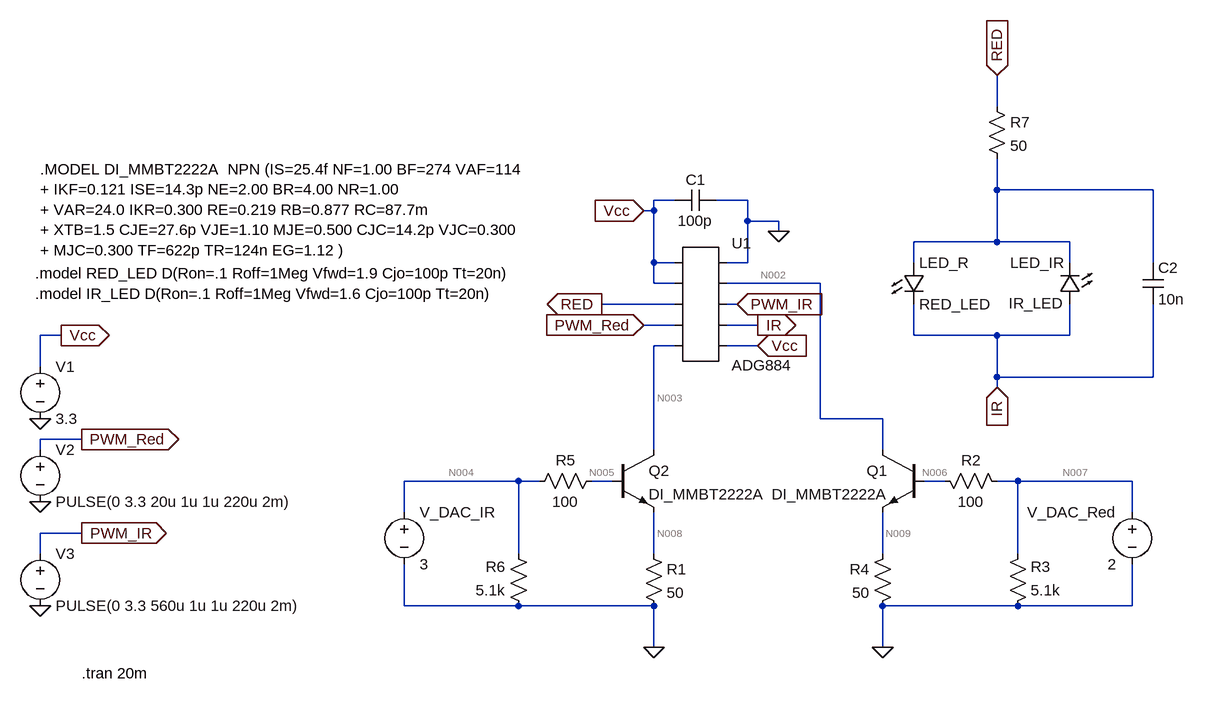
[diagram p0: schematic Mulitplexer.asc]
Mulitplexer.asc, the LTspice schematic file:
Version 4
SHEET 1 1976 680
WIRE 992 -304 992 -352
WIRE 992 -176 992 -224
WIRE 1232 -176 992 -176
WIRE 496 -160 464 -160
WIRE 608 -160 560 -160
WIRE 464 -144 464 -160
WIRE 464 -144 448 -144
WIRE 608 -128 608 -160
WIRE 656 -128 608 -128
WIRE 656 -112 656 -128
WIRE 992 -96 992 -176
WIRE 992 -96 864 -96
WIRE 1104 -96 992 -96
WIRE 464 -64 464 -144
WIRE 496 -64 464 -64
WIRE 608 -64 608 -128
WIRE 608 -64 576 -64
WIRE 864 -64 864 -96
WIRE 1104 -64 1104 -96
WIRE 1232 -64 1232 -176
WIRE 464 -32 464 -64
WIRE 496 -32 464 -32
WIRE 720 -32 576 -32
WIRE 496 0 384 0
WIRE 592 0 576 0
WIRE 496 32 448 32
WIRE 624 32 576 32
WIRE -448 48 -480 48
WIRE 864 48 864 0
WIRE 992 48 864 48
WIRE 1104 48 1104 0
WIRE 1104 48 992 48
WIRE 496 64 464 64
WIRE 624 64 576 64
WIRE -480 96 -480 48
WIRE 992 112 992 48
WIRE 1232 112 1232 0
WIRE 1232 112 992 112
WIRE 992 128 992 112
WIRE 720 176 720 -32
WIRE 816 176 720 176
WIRE -416 208 -480 208
WIRE -480 224 -480 208
WIRE 464 224 464 64
WIRE 816 224 816 176
WIRE 256 272 80 272
WIRE 288 272 256 272
WIRE 400 272 368 272
WIRE 912 272 880 272
WIRE 1024 272 992 272
WIRE 1200 272 1024 272
WIRE 80 320 80 272
WIRE 1200 320 1200 272
WIRE -416 352 -480 352
WIRE -480 384 -480 352
WIRE 256 384 256 272
WIRE 464 384 464 320
WIRE 816 384 816 320
WIRE 1024 384 1024 272
WIRE 80 464 80 400
WIRE 256 464 80 464
WIRE 464 464 256 464
WIRE 1024 464 816 464
WIRE 1200 464 1200 400
WIRE 1200 464 1024 464
WIRE 464 528 464 464
WIRE 816 528 816 464
FLAG -448 48 Vcc
IOPIN -448 48 Out
FLAG -416 208 PWM_Red
IOPIN -416 208 Out
FLAG -416 352 PWM_IR
IOPIN -416 352 Out
FLAG -480 176 0
FLAG -480 304 0
FLAG -480 464 0
FLAG 448 -144 Vcc
IOPIN 448 -144 In
FLAG 624 64 Vcc
IOPIN 624 64 In
FLAG 656 -112 0
FLAG 448 32 PWM_Red
IOPIN 448 32 In
FLAG 384 0 RED
IOPIN 384 0 Out
FLAG 624 32 IR
IOPIN 624 32 Out
FLAG 992 -352 RED
IOPIN 992 -352 In
FLAG 992 128 IR
IOPIN 992 128 In
FLAG 816 528 0
FLAG 592 0 PWM_IR
IOPIN 592 0 In
FLAG 464 528 0
SYMBOL AutoGenerated\\ADG884 528 0 R0
SYMATTR InstName U1
SYMBOL LED 848 -64 R0
SYMATTR InstName LED_R
SYMATTR Value RED_LED
SYMBOL LED 1120 0 R180
WINDOW 0 24 64 Left 2
WINDOW 3 68 -14 Top 2
SYMATTR InstName LED_IR
SYMATTR Value IR_LED
SYMBOL voltage -480 80 R0
WINDOW 123 0 0 Left 0
WINDOW 39 0 0 Left 0
SYMATTR InstName V1
SYMATTR Value 3.3
SYMBOL voltage -480 208 R0
WINDOW 123 0 0 Left 0
WINDOW 39 0 0 Left 0
SYMATTR InstName V2
SYMATTR Value PULSE(0 3.3 20u 1u 1u 220u 2m)
SYMBOL voltage -480 368 R0
WINDOW 123 0 0 Left 0
WINDOW 39 0 0 Left 0
SYMATTR InstName V3
SYMATTR Value PULSE(0 3.3 560u 1u 1u 220u 2m)
SYMBOL cap 560 -176 R90
WINDOW 0 0 32 VBottom 2
WINDOW 3 32 32 VTop 2
SYMATTR InstName C1
SYMATTR Value 100p
SYMBOL npn 880 224 M0
SYMATTR InstName Q1
SYMATTR Value DI_MMBT2222A
SYMBOL res 832 368 M0
SYMATTR InstName R4
SYMATTR Value 50
SYMBOL res 896 256 M90
WINDOW 0 0 56 VBottom 2
WINDOW 3 32 56 VTop 2
SYMATTR InstName R2
SYMATTR Value 100
SYMBOL res 1008 480 M180
WINDOW 0 36 76 Left 2
WINDOW 3 36 40 Left 2
SYMATTR InstName R3
SYMATTR Value 5.1k
SYMBOL voltage 1200 304 M0
WINDOW 123 0 0 Left 0
WINDOW 39 0 0 Left 0
SYMATTR InstName V_DAC_Red
SYMATTR Value 2
SYMBOL npn 400 224 R0
SYMATTR InstName Q2
SYMATTR Value DI_MMBT2222A
SYMBOL res 448 368 R0
SYMATTR InstName R1
SYMATTR Value 50
SYMBOL res 384 256 R90
WINDOW 0 0 56 VBottom 2
WINDOW 3 32 56 VTop 2
SYMATTR InstName R5
SYMATTR Value 100
SYMBOL res 272 480 R180
WINDOW 0 36 76 Left 2
WINDOW 3 36 40 Left 2
SYMATTR InstName R6
SYMATTR Value 5.1k
SYMBOL voltage 80 304 R0
WINDOW 123 0 0 Left 0
WINDOW 39 0 0 Left 0
SYMATTR InstName V_DAC_IR
SYMATTR Value 3
SYMBOL cap 1216 -64 R0
SYMATTR InstName C2
SYMATTR Value 10n
SYMBOL res 976 -320 R0
SYMATTR InstName R7
SYMATTR Value 50
TEXT -488 -48 Left 2 !.model RED_LED D(Ron=.1 Roff=1Meg Vfwd=1.9 Cjo=100p Tt=20n)
TEXT -488 -16 Left 2 !.model IR_LED D(Ron=.1 Roff=1Meg Vfwd=1.6 Cjo=100p Tt=20n)
TEXT -480 -208 Left 2 !.MODEL DI_MMBT2222A  NPN (IS=25.4f NF=1.00 BF=274 VAF=114 \n+ IKF=0.121 ISE=14.3p NE=2.00 BR=4.00 NR=1.00 \n+ VAR=24.0 IKR=0.300 RE=0.219 RB=0.877 RC=87.7m \n+ XTB=1.5 CJE=27.6p VJE=1.10 MJE=0.500 CJC=14.2p VJC=0.300 \n+ MJC=0.300 TF=622p TR=124n EG=1.12 )
TEXT -416 568 Left 2 !.tran 20m

The netlist it stands for:
* Mulitplexer.asc
* U1: ADG884 (symbol AutoGenerated\ADG884 not available, pins judged from their places): pin1=Vcc pin2=Vcc pin3=RED pin4=PWM_Red pin5=N003 pin6=0 pin7=N002 pin8=PWM_IR pin9=IR pin10=Vcc
D§LED_R N001 IR RED_LED
D§LED_IR IR N001 IR_LED
V1 Vcc 0 3.3
V2 PWM_Red 0 PULSE(0 3.3 20u 1u 1u 220u 2m)
V3 PWM_IR 0 PULSE(0 3.3 560u 1u 1u 220u 2m)
C1 0 Vcc 100p
Q1 N002 N006 N009 0 DI_MMBT2222A
R4 N009 0 50
R2 N006 N007 100
R3 0 N007 5.1k
V_DAC_Red N007 0 2
Q2 N003 N005 N008 0 DI_MMBT2222A
R1 N008 0 50
R5 N005 N004 100
R6 0 N004 5.1k
V_DAC_IR N004 0 3
C2 N001 IR 10n
R7 RED N001 50
.model D D
.lib standard.dio
.model NPN NPN
.model PNP PNP
.lib standard.bjt
.model RED_LED D(Ron=.1 Roff=1Meg Vfwd=1.9 Cjo=100p Tt=20n)
.model IR_LED D(Ron=.1 Roff=1Meg Vfwd=1.6 Cjo=100p Tt=20n)
.MODEL DI_MMBT2222A  NPN (IS=25.4f NF=1.00 BF=274 VAF=114
+ IKF=0.121 ISE=14.3p NE=2.00 BR=4.00 NR=1.00
+ VAR=24.0 IKR=0.300 RE=0.219 RB=0.877 RC=87.7m
+ XTB=1.5 CJE=27.6p VJE=1.10 MJE=0.500 CJC=14.2p VJC=0.300
+ MJC=0.300 TF=622p TR=124n EG=1.12 )
.tran 20m
.backanno
.end

* Results of the author's LTspice run, read from the files saved beside the schematic
* Operating Point, zero values left out:
*   V(vcc) = 3.3 V
*   V(n002) = 430.2 mV
*   V(n006) = 1.159 V
*   V(n009) = 420.5 mV
*   V(n007) = 2 V
*   V(n003) = 758.3 mV
*   V(n005) = 1.508 V
*   V(n008) = 746.2 mV
*   V(n004) = 3 V
*   Ib(Q2) = 14.92 mA
*   Ie(Q2) = -14.92 mA
*   Ib(Q1) = 8.411 mA
*   Ie(Q1) = -8.411 mA
*   I(R6) = -588.2 µA
*   I(R5) = -14.92 mA
*   I(R1) = 14.92 mA
*   I(R3) = -392.2 µA
*   I(R2) = -8.411 mA
*   I(R4) = 8.411 mA
*   I(V_dac_ir) = -15.51 mA
*   I(V_dac_red) = -8.803 mA